# Altium schematic sheet MotherBoard_AuxiliarySystem.SchDoc
size A; SheetNumber: 4; SheetTotal: 9
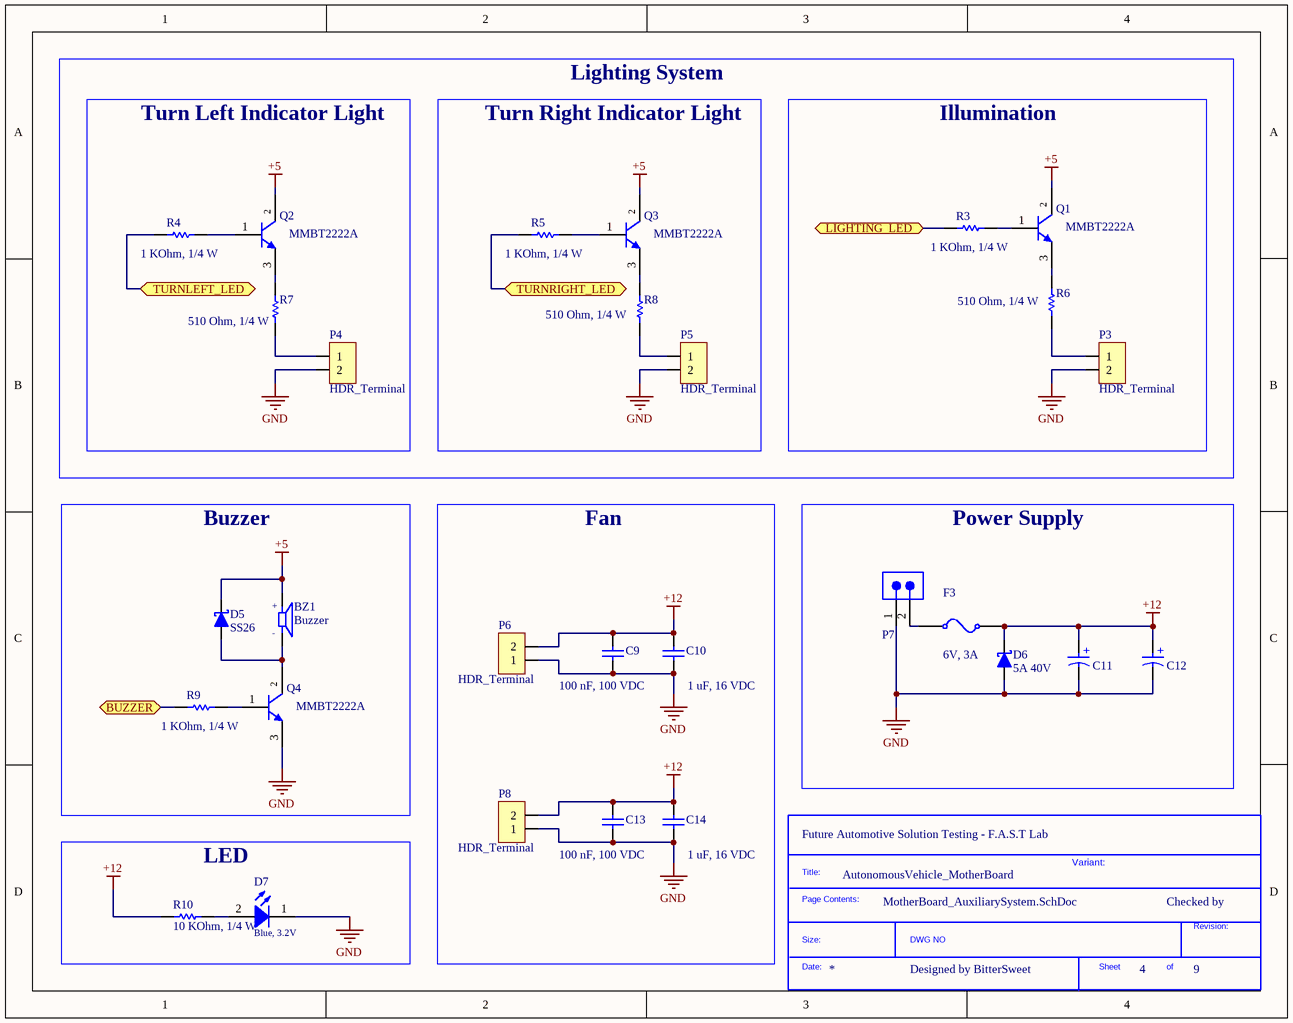
[diagram p0: MotherBoard_AuxiliarySystem.SchDoc]

## Parts
*?  SDTitleBlock  (value not drawn)  (graphical)
BZ1  Buzzer  [BUZZER_DIP_9X4.2]
C9  100 nF, 100 VDC  [CAP_0603]
C10  1 uF, 16 VDC  [CAP_0603]
C11  100uF, 16V  [WCAP-ASLI_D6.3H5.5]  (value not drawn)
C12  10uF, 25V  [WCAP-ASLI_D4H5.5]  (value not drawn)
C13  100 nF, 100 VDC  [CAP_0603]
C14  1 uF, 16 VDC  [CAP_0603]
D5  SS26  [DO-214AB, SMA]
D6  5A 40V  [DO-214AB, SMA]
D7  Blue, 3.2V  [WL-SMCW_0603_H=0.7mm]
F3  6V, 3A  [Fuse_SMD_1812]
P3  HDR_Terminal  [HDR_HEADER_2.0_HORIZONTAL]
P4  HDR_Terminal  [HDR_HEADER_2.0_HORIZONTAL]
P5  HDR_Terminal  [HDR_HEADER_2.0_HORIZONTAL]
P6  HDR_Terminal  [HDR_HEADER_2.0_HORIZONTAL]
P7  20A, 300V  [691312510002]  (value not drawn)
P8  HDR_Terminal  [HDR_HEADER_2.0_HORIZONTAL]
Q1  MMBT2222A  [MMBT-SOT23]
Q2  MMBT2222A  [MMBT-SOT23]
Q3  MMBT2222A  [MMBT-SOT23]
Q4  MMBT2222A  [MMBT-SOT23]
R3  1 KOhm, 1/4 W  [resistor_0603]
R4  1 KOhm, 1/4 W  [resistor_0603]
R5  1 KOhm, 1/4 W  [resistor_0603]
R6  510 Ohm, 1/4 W  [resistor_0603]
R7  510 Ohm, 1/4 W  [resistor_0603]
R8  510 Ohm, 1/4 W  [resistor_0603]
R9  1 KOhm, 1/4 W  [resistor_0603]
R10  10 KOhm, 1/4 W  [resistor_0603]

## Blocks framed on the sheet
Turn Left Indicator Light: P4 Q2 R4 R7
Illumination: P3 Q1 R3 R6
Buzzer: BZ1 D5 Q4 R9
Fan: C9 C10 C13 C14 P6 P8
Power Supply: C11 C12 D6 F3 P7
LED: D7 R10

## Ports
BUZZER (bidir), LIGHTING_LED (bidir), TURNLEFT_LED (bidir), TURNRIGHT_LED (bidir)

## Nets
+5: BZ1.P D5.2(K) Q1.2(C) Q2.2(C) Q3.2(C)
+12: C9.2 C10.2 C11.1(P) C12.1(P) C13.2 C14.2 D6.2(K) F3.1 P6.2 P8.2 R10.1
GND: C9.1 C10.1 C11.2(N) C12.2(N) C13.1 C14.1 D6.1(A) D7.1(K) P3.2 P4.2 P5.2 P6.1 P7.1 P8.1 Q4.3(E)
BUZZER: R9.1 ; port BUZZER
LIGHTING_LED: R3.1 ; port LIGHTING_LED
TURNLEFT_LED: R4.1 ; port TURNLEFT_LED
TURNRIGHT_LED: R5.1 ; port TURNRIGHT_LED
NetBZ1_M: BZ1.M D5.1(A) Q4.2(C)
NetD7_2: D7.2(A) R10.2
NetF3_0: F3.0 P7.2
NetP3_1: P3.1 R6.1
NetP4_1: P4.1 R7.1
NetP5_1: P5.1 R8.1
NetQ1_1: Q1.1(B) R3.2
NetQ1_3: Q1.3(E) R6.2
NetQ2_1: Q2.1(B) R4.2
NetQ2_3: Q2.3(E) R7.2
NetQ3_1: Q3.1(B) R5.2
NetQ3_3: Q3.3(E) R8.2
NetQ4_1: Q4.1(B) R9.2

## Notes on the sheet
- Lighting System
- Turn Right Indicator Light
- (near *?) Future Automotive Solution Testing - F.A.S.T Lab
- AutonomousVehicle_MotherBoard
- Variant:
- Checked by
- Designed by BitterSweet
- (in symbol 865080343009) +
- (in symbol 865080440002) +
- (in symbol Buzzer) +; -
- (in symbol SDTitleBlock) Title:; Page Contents:; Revision:; Size:; DWG NO; Date:; Sheet; of

## Library data of the parts
BZ1 = Buzzer: Frequency DIP Buzzer, 9x4.2mm, 80dB, 9056-TS; URL: https://www.thegioiic.com/9056-ts-dip-buzzer-tan-so-9x4-2mm-80db
C9 C13 = 0106031041050: CAP, size 0603, 100 nF, 16 VDC; Manufacture Name: TDK; Manufacture SN: CGA3E3X8R1H104K080AE; Capacitance: 100 nF; Tolerance: +/-10%; Voltage Rating DC: 16 VDC; ComponentLink2Description: Datasheet; ComponentLink2URL: https://product.tdk.com/system/files/dam/doc/product/capacitor/ceramic/mlcc/catalog/mlcc_automotive_soft_en.pdf?ref_disty=mouser; Operating Temperature: -55 to +125degC; Packaging: Tape and Reel; Mounting Technology: SMT; Size: 0603; Supplier 1 Name: Mouser; Supplier 1 SN: 810-CGA3E3X8R1H104KA; Supplier 1 URL: https://www.mouser.com/ProductDetail/TDK/CGA3E3X8R1H104K080AE?qs=nQSIdc08i%252Bd8g3IRRgU2bw%3D%3D&utm_source=mouser-refine-download&utm_medium=file&utm_campaign=CGA3E3X8R1H104K080AE&utm_content=TDK; Supplier 2 Name: Digi-Key; Supplier 2 SN: 445-173697-2-ND; Supplier 2 URL: https://www.digikey.com/en/products/detail/tdk-corporation/cga3e3x8r1h104k080ae/5809262; Supplier 3 Name: thegioiic; Supplier 3 SN: N/A; Supplier 3 URL: N/A; Value: 100 nF, 100 VDC; ComponentLink3Description: JLCPCB Link; ComponentLink3URL: https://jlcpcb.com/partdetail/89397-0603B104K101NT/C88219; JLCPCB Part: C88219
C10 C14 = 0106031051016: CAP, size 0603, 1 uF, 16 VDC; Manufacture Name: Samsung Electro-Mechanics; Manufacture SN: CL10B105KO8NNWC; Capacitance: 1 uF; Tolerance: +/-10%; Voltage Rating DC: 16 VDC; ComponentLink2Description: Datasheet; ComponentLink2URL: https://www.mouser.vn/datasheet/2/585/Samsung_MLCC_1837944-1929650.pdf; Operating Temperature: -55 to +125degC; Packaging: Tape and Reel; Mounting Technology: SMT; Size: 0603; Supplier 1 Name: Mouser; Supplier 1 SN: 187-CL10B105KO8NNWC; Supplier 1 URL: https://www.mouser.vn/ProductDetail/Samsung-Electro-Mechanics/CL10B105KO8NNWC?qs=81r%252BiQLm7BT%252BXtc72qn1ug%3D%3D&utm_source=mouser-refine-download&utm_medium=file&utm_campaign=CL10B105KO8NNWC&utm_content=Samsung-Electro-Mechanics; Supplier 2 Name: Digi-Key; Supplier 2 SN: 1276-CL10B105KO8NNWCTR-ND; Supplier 2 URL: https://www.digikey.com/en/products/detail/samsung-electro-mechanics/cl10b105ko8nnwc/16572783; Supplier 3 Name: thegioiic; Supplier 3 SN: N/A; Supplier 3 URL: https://www.thegioiic.com/tu-gom-0603-1uf-16v; Value: 1 uF, 16 VDC; ComponentLink3Description: JLCPCB Link; ComponentLink3URL: https://jlcpcb.com/partdetail/172593-GCM188R71C105KA64D/C161212; JLCPCB Part: C161212
C11 = 865080343009: V-Chip, D6.3 x H5.5mm, 100uF, 16V; Manufacturer: Wurth Elektronik; Capacitance Tolerance: +/-20%; Dissipation Factor: 16%; Endurance: 2000h; Leakage Current: 16uA; Ripple Current: 255mA; Category: Aluminum Electrolytic Capacitors; ComponentLink2Description: Datasheet Link; ComponentLink2URL: https://www.we-online.com/redexpert/spec/865080343009?ad; Mount: Surface Mount; Operating Temperature Max: 105°C; Operating Temperature Min: -55°C; Packaging: Tape and Reel; Height: 5.5mm; Diameter: 6.3mm; Capacitance: 100uF; Rated Voltage (DC): 16V; Supplier 1 Name: Mouser; Supplier 1 SN: 710-865080343009; Supplier 1 URL: https://www.mouser.com/ProductDetail/Wurth-Elektronik/865080343009?qs=0KOYDY2FL28Gid9q%2FqirTQ%3D%3D; Supplier 3 Name: thegioiic; Supplier 3 URL: https://www.thegioiic.com/tu-nhom-smd-100uf-16v-6-3x5-4mm; Manufacturer Part Number: N/A; Supplier 2 Name: Digi-Key; Supplier 2 SN: N/A; Supplier 2 URL: N/A; Supplier 3 SN: N/A; Value: 100uF, 16V
C12 = 865080440002: V-Chip, D4 x H5.5mm, 10uF, 25V; Manufacturer: Wurth Elektronik; Capacitance Tolerance: +/-20%; Dissipation Factor: 14%; Endurance: 2000h; Leakage Current: 3uA; Ripple Current: 85mA; Category: Aluminum Electrolytic Capacitors; ComponentLink2Description: Datasheet Link; ComponentLink2URL: https://www.we-online.com/redexpert/spec/865080440002?ad; Mount: Surface Mount; Operating Temperature Max: 105°C; Operating Temperature Min: -55°C; Packaging: Tape and Reel; Height: 5.5mm; Diameter: 4mm; Capacitance: 10uF; Rated Voltage (DC): 25V; Supplier 1 Name: Mouser; Supplier 1 SN: 710-865080440002; Supplier 1 URL: https://www.mouser.com/ProductDetail/Wurth-Elektronik/865080440002?qs=0KOYDY2FL2%2FXvxJ7qSnXzw%3D%3D; Supplier 3 Name: thegioiic; Supplier 3 URL: https://www.thegioiic.com/tu-nhom-smd-10uf-25v-4x5-4mm; Manufacturer Part Number: N/A; Supplier 2 Name: Digi-Key; Supplier 2 SN: N/A; Supplier 2 URL: N/A; Supplier 3 SN: N/A; Value: 10uF, 25V
D5 = Diode_Schottky: SS26 SMA Diode Schottky 5A 40V; ComponentLink1Description: JLCPCB Link; ComponentLink1URL: https://jlcpcb.com/partdetail/Yint-SS26/C5123304; JLCPLCB Part: C5123304
D6 = Diode_Schottky: SS54 SMC Diode Schottky 5A 40V
D7 = 160603BlueClear: WL-SMCW SMT Mono-color Chip LED Waterclear, size 0603, Blue, 3.2V, 140deg; Type: Clear; Color: Blue; Size: 0603; ComponentLink1Description: Datasheet link; ComponentLink1URL: N/A; ComponentLink2Description: Supplier 1 URL; ComponentLink2URL: https://www.mouser.vn/ProductDetail/Wurth-Elektronik/150060BS75003?qs=Li%252BoUPsLEnu8LvIbM48DKA%3D%3D; ComponentLink3Description: Supplier 2 URL; ComponentLink3URL: https://www.digikey.com/en/products/detail/liteon/LTST-C191TBKT/388530; ComponentLink4Description: Supplier 3 URL; ComponentLink4URL: https://www.thegioiic.com/led-xanh-duong-0603-dan-smd-trong-suot; Supplier 1 Name: Mouser; Supplier 1 SN: 710-150060GS75000; Supplier 1 URL: https://www.mouser.vn/ProductDetail/Wurth-Elektronik/150060BS75003?qs=Li%252BoUPsLEnu8LvIbM48DKA%3D%3D; Supplier 2 Name: Digi-Key; Supplier 2 SN: 160-1647-2-ND; Supplier 2 URL: https://www.digikey.com/en/products/detail/liteon/LTST-C191TBKT/388530; Supplier 3 Name: ICDayRoi; Supplier 3 SN: N/A; Supplier 3 URL: https://www.thegioiic.com/led-xanh-duong-0603-dan-smd-trong-suot; Value: Blue, 3.2V; JLCPCB Part: C99290; ComponentLink5Description: JLCPCB Link; ComponentLink5URL: https://jlcpcb.com/partdetail/LiteOn-LTSTC191TBKT/C99290
F3 = 061812300006: Resettable Fuse, Size 1812, 6V, 3A; Manufacturer: Littelfuse; Threshold Current: 100A; Trip Current: 6A; Threshold Voltage: 6V; Hold Current: 3A; Size: 1812; Mounting Technology: SMT/SMD; ComponentLink1Description: Datasheet link; ComponentLink1URL: https://www.littelfuse.com/~/media/electronics/product_specifications/resettable_ptcs/littelfuse_ptc_minismdc300f_2_product_specification.pdf.pdf; ComponentLink2Description: Supplier 1 URL; ComponentLink2URL: https://www.mouser.vn/ProductDetail/Littelfuse/MINISMDC300F-2?qs=NBx1VnXdadznR1WtAMXLew%3D%3D; ComponentLink3Description: Supplier 2 URL; ComponentLink3URL: https://www.digikey.com/en/products/detail/littelfuse-inc/MINISMDC300F-2/3885071?s=N4IgjCBcoGwBwCYqgMZQGYEMA2BnApgDQgD2UA2iAMwAEAgiALrEAOALlCAKoB2AlmwDy6ALL5MuAK4AnfCAC%2BxeFWQg0kLHiKkKIGPSasOkbvyGjxU2QqVwYq9ZoLEykSghgB2ACwBWJMwg7JwAymzSfDwA5jYgCAAMnkjQahg4zjpu4PHxBoHBJrwCwmISMnKKcYm%2BDmlaLrpU%2BgC2ggAWzbiGQcamxRZl1vKVyZTokgRM8kA; ComponentLink4Description: Supplier 3 URL; ComponentLink4URL: https://www.thegioiic.com/cau-chi-tu-phuc-hoi-1812-6v-3a; Supplier 1 Name: Mouser; Supplier 1 SN: 650-MINISMDC300F-2; Supplier 1 URL: https://www.mouser.vn/ProductDetail/Littelfuse/MINISMDC300F-2?qs=NBx1VnXdadznR1WtAMXLew%3D%3D; Supplier 2 Name: Digi-Key; Supplier 2 SN: MINISMDC300F-2TR-ND; Supplier 2 URL: https://www.mouser.vn/ProductDetail/Littelfuse/MINISMDC300F-2?qs=NBx1VnXdadznR1WtAMXLew%3D%3D; Supplier 3 Name: thegioiic; Supplier 3 SN: N/A; Supplier 3 URL: https://www.thegioiic.com/cau-chi-tu-phuc-hoi-1812-6v-3a; Value: 6V, 3A
P3-P6 P8 = HDR_Terminal: HDR_Terminal 2 pin; Supplier: ThegioiIC; ComponentLink1Description: URL; ComponentLink1URL: https://www.thegioiic.com/kf128-2-v-domino-2-chan-thang-3-5mm-300v-10a-han-pcb
P7 = 691312510002: WR-TBL Series 312 Open Horizontal PCB Header, THT, pitch 5.08mm, 2p; Manufacturer: Wurth Elektronik; Modularity: No; ComponentLink1Description: Datasheet Link; ComponentLink1URL: https://www.we-online.com/redexpert/spec/691312510002?ad; ComponentLink2Description: Supplier 1 URL; ComponentLink2URL: N/A; Manufacturer Part Number: 691312510002; Category: Terminal Blocks; Match Code: WR-TBL; Mount: Through Hole; Operating Temperature Max: 105°C; Operating Temperature Min: -40°C; Packaging: Box; Application: Pluggable; Number of Pins: 2; Number of Rows: 1; Orientation: Horizontal; Pitch: 5.08mm; Rated Current: 20A; Working Voltage: 300V; ComponentLink3Description: Supplier 2 URL; ComponentLink3URL: N/A; ComponentLink4Description: Supplier 3 URL; ComponentLink4URL: https://www.thegioiic.com/kf-5-08-2-r-terminal-block-plug-in-han-pcb-2-chan-cong-5-08mm-300v-15a; Supplier 1 Name: Mouser; Supplier 1 SN: N/A; Supplier 1 URL: N/A; Supplier 2 Name: Digi-Key; Supplier 2 SN: N/A; Supplier 2 URL: N/A; Supplier 3 Name: thegioiic; Supplier 3 SN: N/A; Supplier 3 URL: https://www.thegioiic.com/kf-5-08-2-r-terminal-block-plug-in-han-pcb-2-chan-cong-5-08mm-300v-15a; Value: 20A, 300V
Q1-Q4 = MMBT2222A: TRANS NPN, 40V, 600MA, SOT23-3; DC Current Gain: 35-300; Gain Bandwidth Product fT: 250MHz; Power Dissipation: 250mW; Current - Collector: 600mA; Package: SOT-23; Supplier 1 Name: Mouser; Supplier 1 SN: 637-MMBT2222A; Supplier 1 URL: https://www.mouser.vn/ProductDetail/Diotec-Semiconductor/MMBT2222A?qs=OlC7AqGiEDl9N1c3%252BL%2F%252Brw%3D%3D; Supplier 2 Name: Digi-Key; Supplier 2 SN: 2796-MMBT2222ATR-ND; Supplier 2 URL: https://www.digikey.com/en/products/detail/diotec-semiconductor/MMBT2222A/13163394; Supplier 3 Name: thegioiic; Supplier 3 URL: https://www.thegioiic.com/mmbt2222a-transistor-npn-40v-0-6a-3-chan-sot-23; Transistor Type: NPN; Voltage - Collector Emitter Breakdown: 40V; Supplier 3 SN: N/A; Value: MMBT2222A; JLCPCB Part: C511875; ComponentLink1Description: JLCPCB Link; ComponentLink1URL: https://jlcpcb.com/partdetail/BORN-MMBT2222A/C511875
R3-R5 R9 = 0006031021: RES, size 0603, 1 KOhm, 1/4 W; Manufacture  Name: OEM; Resistance: 1 KOhm; Rated Power: 1/4 W; Resistance Tolerance: +/-1%; Size: 0603; Mounting Technology: SMT; Supplier 1 Name: Mouser; Supplier 1 SN: 71-RCS06031K00FKEA; Supplier 2 Name: Digi-Key; Supplier 2 SN: YAG5829TR-ND YAG5829CT-ND YAG5829DKR-ND; Supplier 1 URL: https://www.mouser.vn/ProductDetail/Vishay-Dale/RCS06031K00FKEA?qs=sGAEpiMZZMvdGkrng054t9clqp6gtJJdzI9PGMrTQi4RTIuHToNahw%3D%3D; Supplier 3 Name: thegioiic; Supplier 3 SN: N/A; Supplier 3 URL: N/A; Manufacture  SN: OEM; Value: 1 KOhm, 1/4 W; ComponentLink1Description: Datasheet link; ComponentLink1URL: https://www.yageo.com/upload/media/product/productsearch/datasheet/rchip/PYu-SR_20105_RoHS_L_10.pdf; ComponentLink2Description: Supplier 1 URL; ComponentLink2URL: N/A; ComponentLink3Description: Supplier 2 URL; ComponentLink3URL: https://www.digikey.com/en/products/detail/yageo/SR0603FR-7T1KL/9373103; ComponentLink4Description: Supplier 3 URL; ComponentLink4URL: N/A; Supplier 2 URL: https://www.digikey.com/en/products/detail/yageo/SR0603FR-7T1KL/9373103; JLCPCB Part: C375503; ComponentLink5Description: JLCPCB Link; ComponentLink5URL: https://jlcpcb.com/partdetail/Yageo-RT0603FRE071KL/C375503
R6-R8 = 0006035111: RES, size 0603, 510 Ohm, 1/4 W; Manufacture  Name: OEM; Resistance: 510 Ohm; Rated Power: 1/4 W; Resistance Tolerance: +/-1%; Size: 0603; Mounting Technology: SMT; Supplier 1 Name: Mouser; Supplier 1 SN: 667-ERJ-UP3F5100V; Supplier 2 Name: Digi-Key; Supplier 2 SN: P17401TR-ND P17401CT-ND P17401DKR-ND; Supplier 1 URL: https://www.mouser.vn/ProductDetail/Panasonic/ERJ-UP3F5100V?qs=sGAEpiMZZMvdGkrng054twq3eZrCFN89dfK8VohwH1n5T5ZGAc92MQ%3D%3D; Supplier 3 Name: thegioiic; Supplier 3 SN: N/A; Supplier 3 URL: N/A; Manufacture  SN: OEM; Value: 510 Ohm, 1/4 W; ComponentLink1Description: Datasheet link; ComponentLink1URL: https://industrial.panasonic.com/cdbs/www-data/pdf/RDN0000/AOA0000C313.pdf; ComponentLink2Description: Supplier 1 URL; ComponentLink2URL: N/A; ComponentLink3Description: Supplier 2 URL; ComponentLink3URL: https://www.digikey.com/en/products/detail/panasonic-electronic-components/ERJ-3BQFR51V/5647434; ComponentLink4Description: Supplier 3 URL; ComponentLink4URL: N/A; Supplier 2 URL: https://www.digikey.com/en/products/detail/panasonic-electronic-components/ERJ-3BQFR51V/5647434; JLCPCB Part: C140078; ComponentLink5Description: JLCPCB Link; ComponentLink5URL: https://jlcpcb.com/partdetail/151404-RS03K510JT/C140078
R10 = 0006031031: RES, size 0603, 10 KOhm, 1/4 W; Manufacture  Name: OEM; Resistance: 10 KOhm; Rated Power: 1/4 W; Resistance Tolerance: +/-1%; Size: 0603; Mounting Technology: SMT; Supplier 1 Name: Mouser; Supplier 1 SN: 755-ESR03EZPF1002; Supplier 2 Name: Digi-Key; Supplier 2 SN: RHM10KADTR-ND RHM10KADCT-ND RHM10KADDKR-ND; Supplier 1 URL: https://www.mouser.vn/ProductDetail/ROHM-Semiconductor/ESR03EZPF1002?qs=sGAEpiMZZMvdGkrng054t67Efho1F8r6CDeAsqwFse8%3D; Supplier 3 Name: thegioiic; Supplier 3 SN: N/A; Supplier 3 URL: N/A; Manufacture  SN: OEM; Value: 10 KOhm, 1/4 W; ComponentLink1Description: Datasheet link; ComponentLink1URL: https://fscdn.rohm.com/en/products/databook/datasheet/passive/resistor/chip_resistor/esr-e.pdf; ComponentLink2Description: Supplier 1 URL; ComponentLink2URL: https://www.thegioiic.com/dien-tro-10-kohm-0603-1-; ComponentLink3Description: Supplier 2 URL; ComponentLink3URL: https://www.digikey.com/en/products/detail/rohm-semiconductor/ESR03EZPF1002/1983429; ComponentLink4Description: Supplier 3 URL; ComponentLink4URL: N/A; Supplier 2 URL: https://www.digikey.com/en/products/detail/rohm-semiconductor/ESR03EZPF1002/1983429; JLCPCB Part: C2087321; Parameter 1: *; ComponentLink5Description: JLCPCB Link; ComponentLink5URL: https://jlcpcb.com/partdetail/Yageo-RT0603BRD1010KL/C2087321